# EasyEDA Pro project Hotplate.epro

# Schematic ARCHIVE

## Sheets
1 DRAFT(Sequential Symbols): Create Date: 2024-06-05; Page Name: DRAFT(Sequential Symbols); Project Name: Hotplate; Schematic Name: USB Module; Update Date: 2024-07-03; Company: EasyEDA.com; Drawn: EasyEDA; Page Size: A4; Part Number: JLCPCB-002; Reviewed: EasyEDA; Version: V0.1
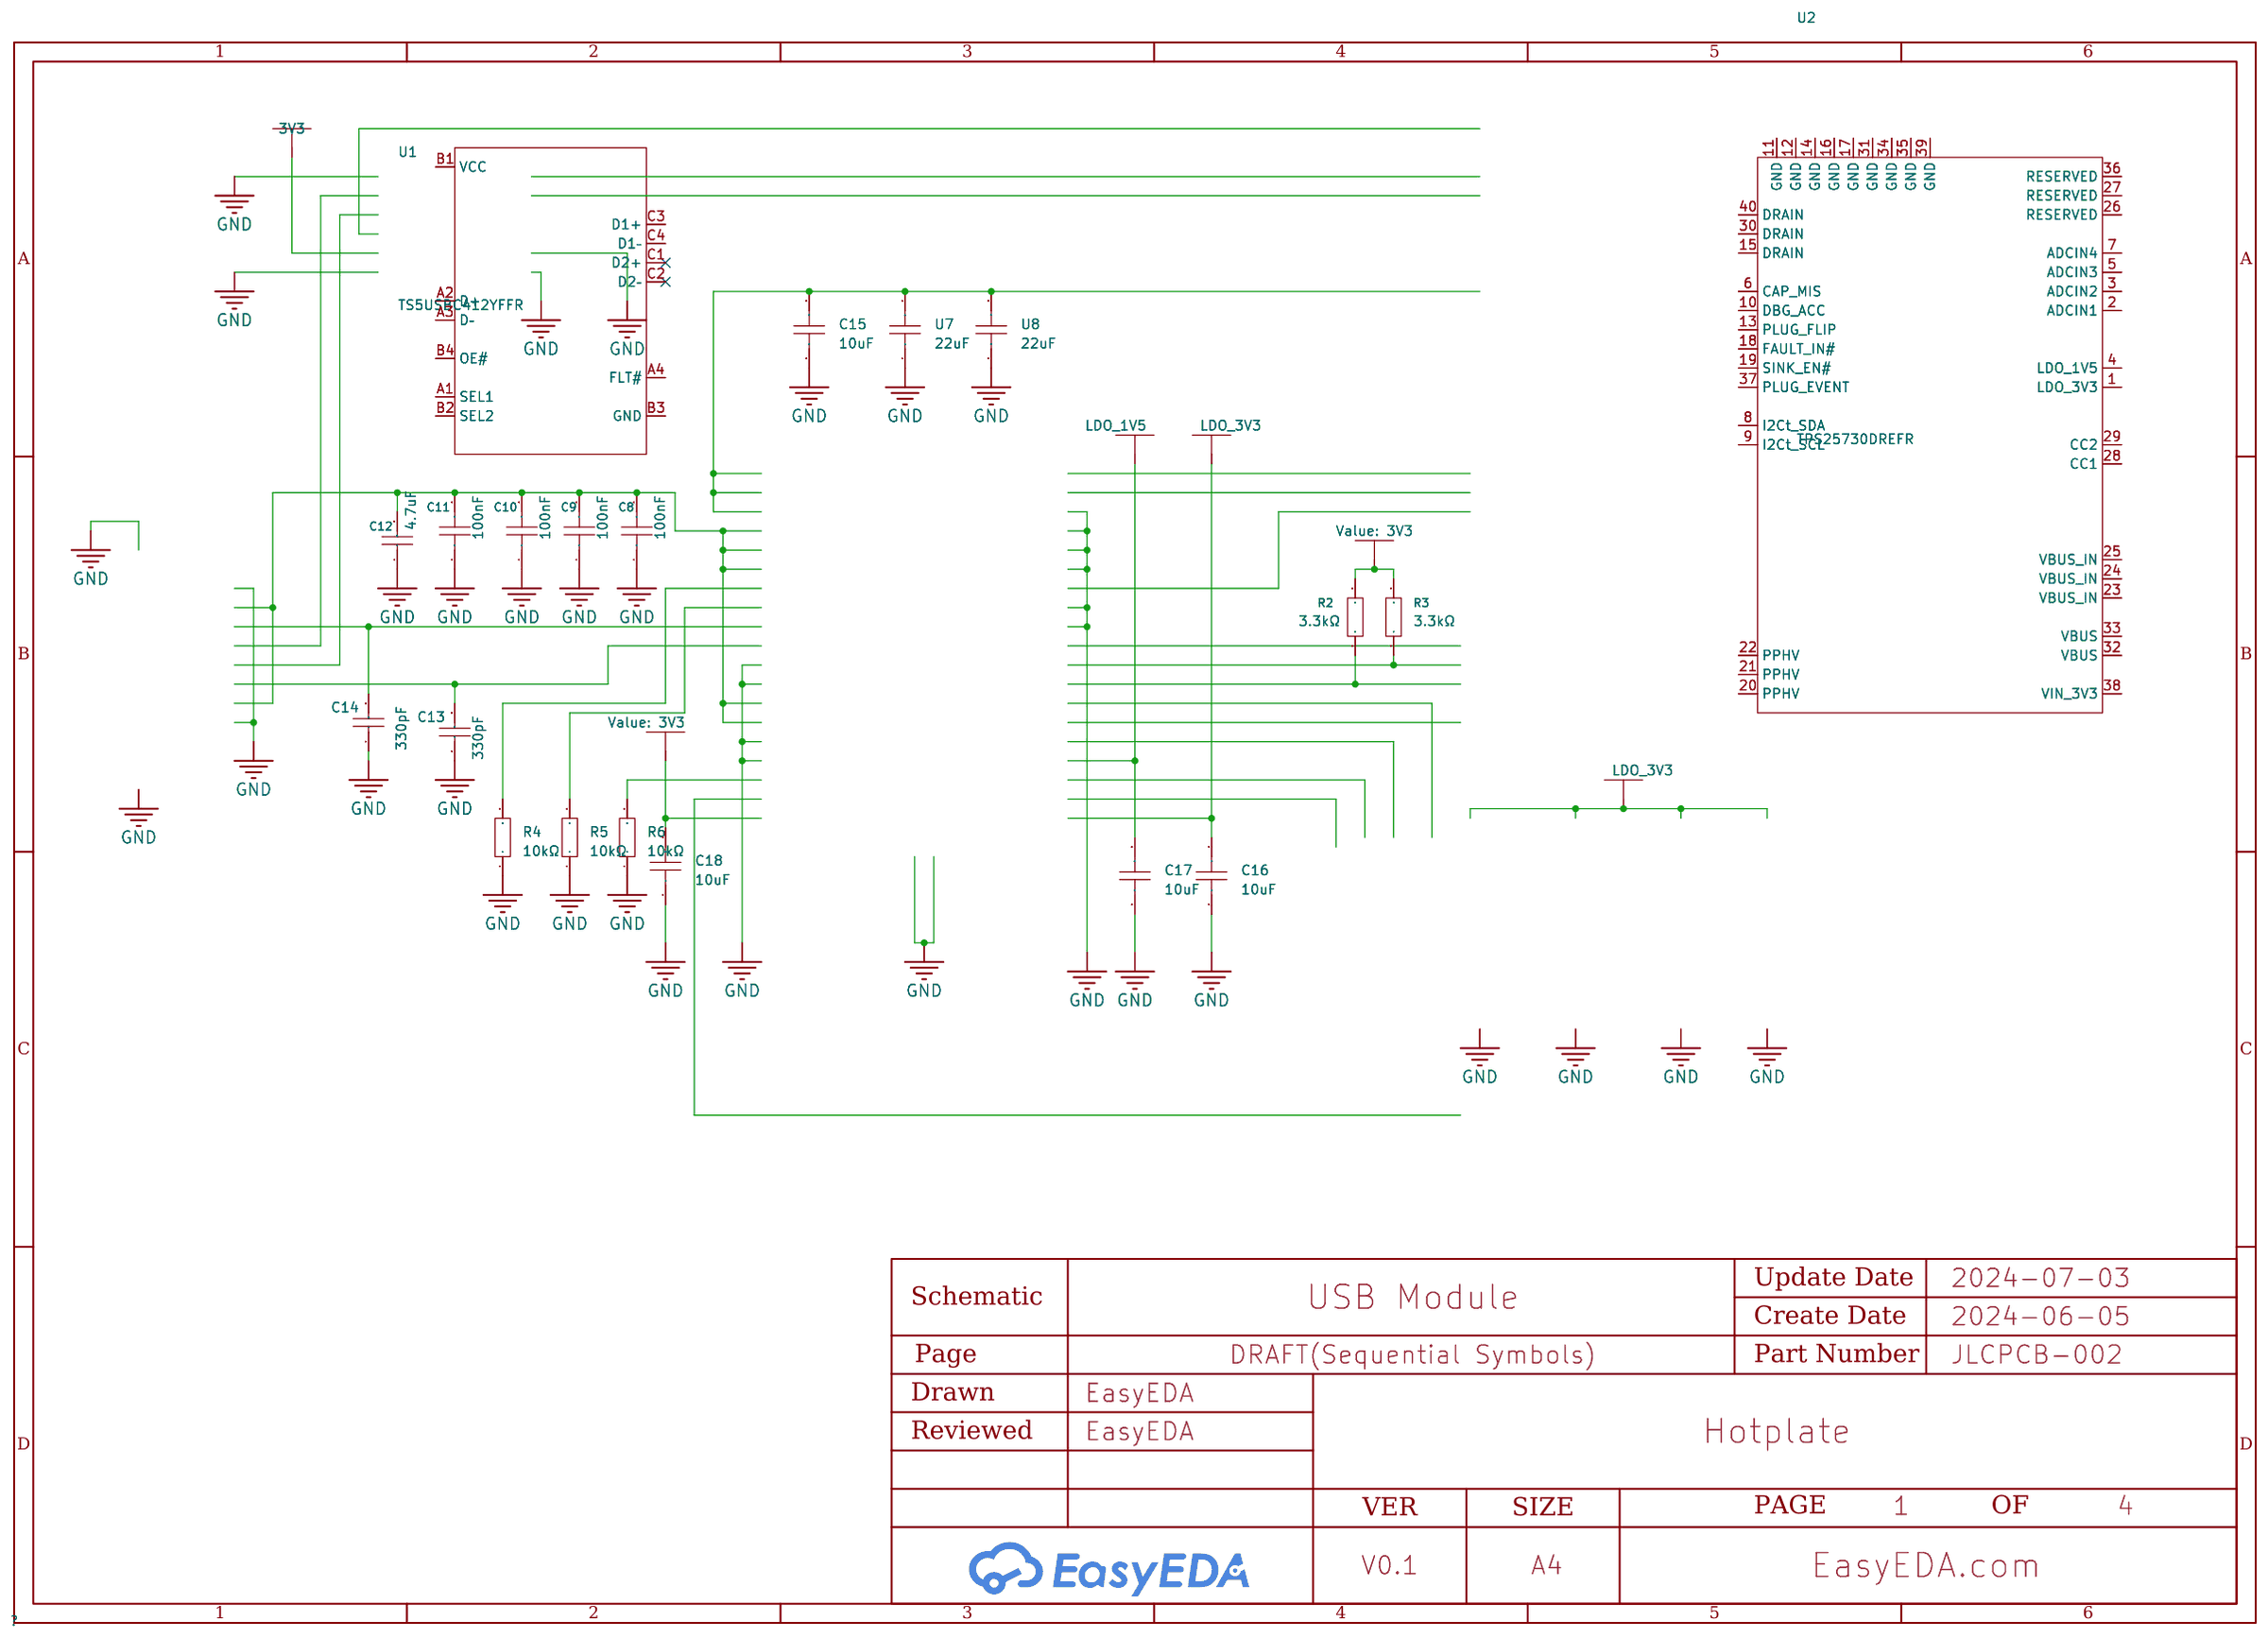
[diagram p0: DRAFT(Sequential Symbols)]
2 Symbols (DELETE): Page Name: Symbols (DELETE); Update Date: 2024-06-05
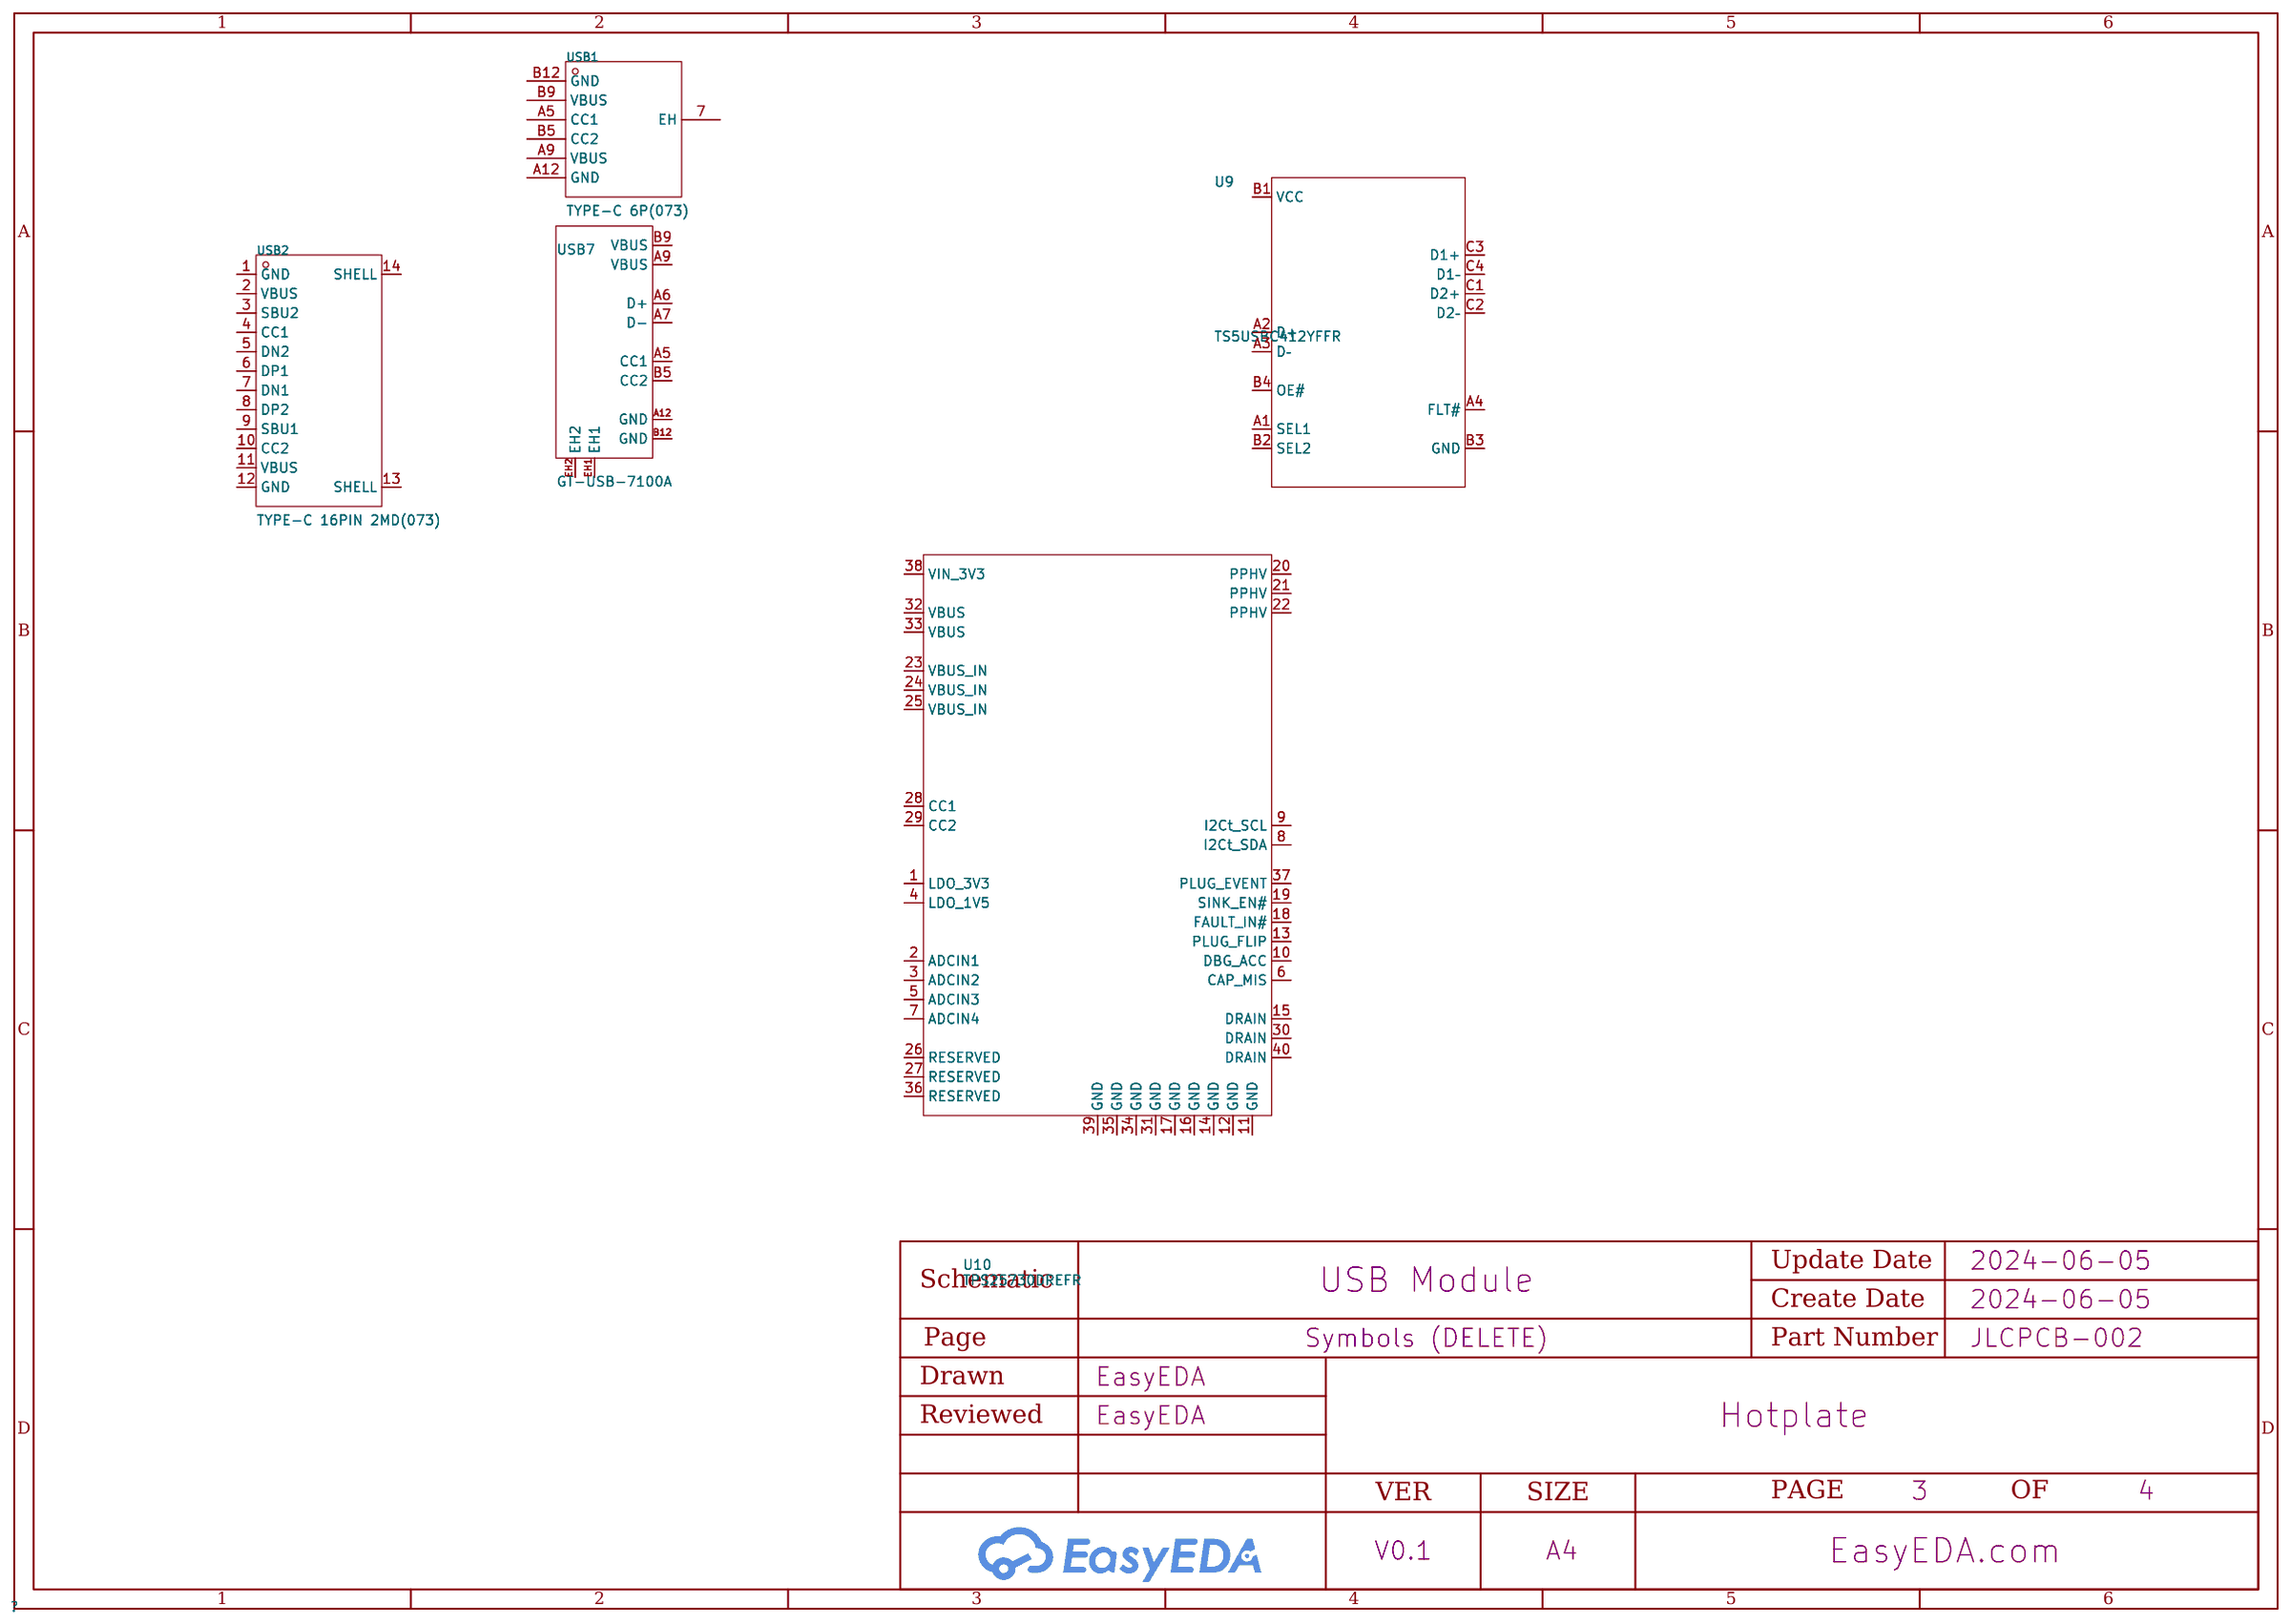
[diagram p1: Symbols (DELETE)]

## Parts
sheet DRAFT(Sequential Symbols)
C8  100nF  [C0603]
C9  100nF  [C0603]
C10  100nF  [C0603]
C11  100nF  [C0603]
C12  4.7uF  [C0603]
C13  330pF  [C0603]
C14  330pF  [C0603]
C15  10uF  [C1210]
C16  10uF  [C1210]
C17  10uF  [C1210]
C18  10uF  [C1210]
R2  3.3kΩ  [R0603]
R3  3.3kΩ  [R0603]
R4  10kΩ  [R0603]
R5  10kΩ  [R0603]
R6  10kΩ  [R0603]
U1  TS5USBC412YFFR  [DSBGA-12_L1.7-W1.3-R4-C3-P0.40-BL]
U2  TPS25730DREFR  [QFN-38_L6.0-W4.0-P0.40-TL-EP_RJK]
U7  22uF  [C1210]
U8  22uF  [C1210]
sheet Symbols (DELETE)
U9  TS5USBC412YFFR  [DSBGA-12_L1.7-W1.3-R4-C3-P0.40-BL]
U10  TPS25730DREFR  [QFN-38_L6.0-W4.0-P0.40-TL-EP_RJK]
USB1  TYPE-C 6P(073)  [TYPE-C-SMD_TYPE-C-6P]
USB2  TYPE-C 16PIN 2MD(073)  [USB-C-SMD_TYPE-C-6PIN-2MD-073]
USB7  GT-USB-7100A  [USB-C-SMD_GT-USB-7100A]

## Library data of the parts
C8-C11 = CC0603KRX7R9BB104: Capacitance: Tolerance:±10% Tolerance:±10% Voltage Rated: Temperature Coefficient:; LCSC Part Name: 100nF ±10% 50V; Supplier Part: C14663; Manufacturer: YAGEO(国巨); Supplier Footprint: 0603; JLCPCB Part Class: Basic Part; Datasheet: https://atta.szlcsc.com/upload/public/pdf/source/20180910/C282072_33301C7F631E79921B82A8DAC6BCC5B3.pdf; Supplier: LCSC; Tolerance: ±10%
C12 = CL10A475KP8NNNC: Capacitance: Tolerance:±10% Tolerance:±10% Voltage Rated: Temperature Coefficient:; LCSC Part Name: 4.7uF ±10% 10V; Supplier Part: C1705; Manufacturer: SAMSUNG(三星); Supplier Footprint: 0603; JLCPCB Part Class: Extended Part; Datasheet: https://atta.szlcsc.com/upload/public/pdf/source/20160218/1457707763339.pdf; Supplier: LCSC; Tolerance: ±10%
C13 C14 = CL10C331JB8NNNC: Capacitance: Tolerance:±5% Tolerance:±5% Voltage Rated: Temperature Coefficient:; LCSC Part Name: 330pF ±5% 50V; Supplier Part: C1664; Manufacturer: SAMSUNG(三星); Supplier Footprint: 0603; JLCPCB Part Class: Basic Part; Datasheet: https://atta.szlcsc.com/upload/public/pdf/source/20160218/1457707763339.pdf; Supplier: LCSC; Tolerance: ±5%
C15-C18 = CS3225X7R106K500NRL: Capacitance: Voltage Rated: Temperature Coefficient:; LCSC Part Name: 10uF 50V; Supplier Part: C2918502; Manufacturer: SAMWHA(三和); Supplier Footprint: 1210; JLCPCB Part Class: Extended Part; Datasheet: https://atta.szlcsc.com/upload/public/pdf/source/20230815/D6EC8E8D4948B4151F2C89DF2FF24A45.pdf; Supplier: LCSC
R2 R3 = 0603WAF3301T5E: Type:Thick Film Resistors Resistance:3.3kΩ Tolerance:±1% Tolerance:±1% Power(Watts): Overload Voltage (Max): Temperature Coefficient:±100ppm/℃ Temperature Coefficient:±100ppm/℃ Operating Temperature Range:-55℃~+155℃ Operating Temperature Range:-55℃~+155℃; LCSC Part Name: 3.3kΩ ±1% 100mW 厚膜电阻; Supplier Part: C22978; Manufacturer: UNI-ROYAL(厚声); Supplier Footprint: 0603; JLCPCB Part Class: Basic Part; Datasheet: https://atta.szlcsc.com/upload/public/pdf/source/20200306/C422600_1E6D84923E4A46A82E41ADD87F860B5C.pdf; Supplier: LCSC; Type: Thick Film Resistors; Tolerance: ±1%; Temperature Coefficient: ±100ppm/℃; Operating Temperature Range: -55℃~+155℃
R4-R6 = RC0603FR-0710KL: Type:Thick Film Resistors Resistance: Tolerance:±1% Tolerance:±1% Power(Watts): Overload Voltage (Max): Temperature Coefficient:±100ppm/℃ Temperature Coefficient:±100ppm/℃ Operating Temperature Range:-55℃~+155℃ Operating Temperature Range:-55℃~+155℃; LCSC Part Name: 厚膜电阻 10kΩ ±1% 100mW; Supplier Part: C98220; Manufacturer: YAGEO(国巨); Supplier Footprint: 0603; JLCPCB Part Class: Extended Part; Datasheet: https://atta.szlcsc.com/upload/public/pdf/source/20180927/C295883_E8D83085EA81BD7DE0B2B681138C15EE.pdf; Supplier: LCSC; Type: Thick Film Resistors; Tolerance: ±1%; Temperature Coefficient: ±100ppm/℃; Operating Temperature Range: -55℃~+155℃
U1 U9 = TS5USBC412YFFR: Switch Circuit:- Number of Channels:2 Supply Voltage:2.3V~5.5V Supply Voltage:2.3V~5.5V On-State Resistance (Max):9Ω Operating Temperature:0℃~+70℃ Operating Temperature:0℃~+70℃; Supplier Part: C2150852; Manufacturer: TI(德州仪器); Supplier Footprint: DSBGA-12; JLCPCB Part Class: Extended Part; Datasheet: https://www.ti.com/cn/lit/gpn/ts5usbc41; Supplier: LCSC; Number of Channels: 2; Supply Voltage: 2.3V~5.5V; On-State Resistance (Max): 9Ω; Operating Temperature: 0℃~+70℃
U2 U10 = TPS25730DREFR: Supplier Part: C22438973; Supplier Footprint: QFN38-4X6-0.4; JLCPCB Part Class: Extended Part; Supplier: LCSC
U7 U8 = CGA1210X5R226K350RT: Capacitance:22uF Tolerance:±10% Tolerance:±10% Voltage Rated: Temperature Coefficient:; LCSC Part Name: 22uF ±10% 35V; Supplier Part: C6120016; Manufacturer: HRE(芯声); Supplier Footprint: 1210; JLCPCB Part Class: Extended Part; Datasheet: https://atta.szlcsc.com/upload/public/pdf/source/20240229/B394560356D0E8099C4BF336FC93CE67.pdf; Supplier: LCSC; Tolerance: ±10%
USB1 = TYPE-C 6P(073): Connector Type:Type-C Standard:- Gender:Female Number of Ports:1 Number of Contacts:6P Mounting Style:卧贴 Current Rating - Power (Max):5A Operating Temperature Range:-25℃~+85℃ Operating Temperature Range:-25℃~+85℃; LCSC Part Name: Type-C 母 卧贴; Supplier Part: C668623; Manufacturer: SHOU HAN(首韩); Supplier Footprint: SMD; JLCPCB Part Class: Extended Part; Datasheet: https://atta.szlcsc.com/upload/public/pdf/source/20200618/C668623_A4B260DED7AC1949BAC6AE39E9F4CD80.pdf; Supplier: LCSC; Connector Type: Type-C; Gender: Female; Number of Ports: 1; Number of Contacts: 6P; Mounting Style: 卧贴; Current Rating - Power (Max): 5A; Operating Temperature Range: -25℃~+85℃
USB2 = TYPE-C 16PIN 2MD(073): Connector Type:Type-C Standard:- Gender:Female Number of Ports:1 Number of Contacts:16P Mounting Style:卧贴 Current Rating - Power (Max):5A Operating Temperature Range:-25℃~+85℃ Operating Temperature Range:-25℃~+85℃; LCSC Part Name: Type-C 母 卧贴; Supplier Part: C2765186; Manufacturer: SHOU HAN(首韩); Supplier Footprint: SMD; JLCPCB Part Class: Extended Part; Datasheet: https://atta.szlcsc.com/upload/public/pdf/source/20211123/39B17C16241EAC15C5E277BDA434118E.pdf; Supplier: LCSC; Connector Type: Type-C; Gender: Female; Number of Ports: 1; Number of Contacts: 16P; Mounting Style: 卧贴; Current Rating - Power (Max): 5A; Operating Temperature Range: -25℃~+85℃
USB7 = GT-USB-7100A: Connector Type:Type-C Standard:USB 2.0 Gender:Female Number of Ports:1 Number of Contacts:8P Mounting Style:Sink board Current Rating - Power (Max):5A Contact Material:高导铜 Contact Plating:Gold Operating Temperature Range:-40℃~+85℃ Operating Temperature Ra; LCSC Part Name: Type-C 母 沉板; Supplier Part: C7469646; Manufacturer: G-Switch(品赞); Supplier Footprint: SMD; JLCPCB Part Class: Extended Part; Datasheet: https://atta.szlcsc.com/upload/public/pdf/source/20240103/5A98FEF604E8D03CC845D83CAD1837C7.pdf; Supplier: LCSC; Connector Type: Type-C; Standard: USB 2.0; Gender: Female; Number of Ports: 1; Number of Contacts: 8P; Mounting Style: Sink board; Current Rating - Power (Max): 5A; Contact Material: 高导铜; Contact Plating: Gold; Operating Temperature Range: -40℃~+85℃

## Nets
3V3: C18.2 R2.1 R3.2
GND: C8.1 C9.1 C10.1 C11.1 C12.1 C13.1 C14.1 C15.1 C16.1 C17.1 C18.1 R4.1 R5.1 R6.1 U7.1 U8.1
LDO_1V5: C17.2
LDO_3V3: C16.2
Net-(C8-2): C8.2 C9.2 C10.2 C11.2 C12.2
Net-(C15-2): C15.2 U7.2 U8.2

Not connected (* = marked no-connect by the designer): C13 2; C14 2; R2 2; R3 1; R4 2; R5 2; R6 2; U1 A1(SEL1) A2(D+) A3(D–) A4(FLT#) B1(VCC) B2(SEL2) B3(GND) B4(OE#) C1(D2+)* C2(D2–)* C3(D1+) C4(D1–); U2 1(LDO_3V3) 2(ADCIN1) 3(ADCIN2) 4(LDO_1V5) 5(ADCIN3) 6(CAP_MIS) 7(ADCIN4) 8(I2Ct_SDA) 9(I2Ct_SCL) 10(DBG_ACC) 11(GND) 12(GND) 13(PLUG_FLIP) 14(GND) 15(DRAIN) 16(GND) 17(GND) 18(FAULT_IN#) 19(SINK_EN#) 20(PPHV) 21(PPHV) 22(PPHV) 23(VBUS_IN) 24(VBUS_IN) 25(VBUS_IN) 26(RESERVED) 27(RESERVED) 28(CC1) 29(CC2) 30(DRAIN) 31(GND) 32(VBUS) 33(VBUS) 34(GND) 35(GND) 36(RESERVED) 37(PLUG_EVENT) 38(VIN_3V3) 39(GND) 40(DRAIN); U9 A1(SEL1) A2(D+) A3(D–) A4(FLT#) B1(VCC) B2(SEL2) B3(GND) B4(OE#) C1(D2+) C2(D2–) C3(D1+) C4(D1–); U10 1(LDO_3V3) 2(ADCIN1) 3(ADCIN2) 4(LDO_1V5) 5(ADCIN3) 6(CAP_MIS) 7(ADCIN4) 8(I2Ct_SDA) 9(I2Ct_SCL) 10(DBG_ACC) 11(GND) 12(GND) 13(PLUG_FLIP) 14(GND) 15(DRAIN) 16(GND) 17(GND) 18(FAULT_IN#) 19(SINK_EN#) 20(PPHV) 21(PPHV) 22(PPHV) 23(VBUS_IN) 24(VBUS_IN) 25(VBUS_IN) 26(RESERVED) 27(RESERVED) 28(CC1) 29(CC2) 30(DRAIN) 31(GND) 32(VBUS) 33(VBUS) 34(GND) 35(GND) 36(RESERVED) 37(PLUG_EVENT) 38(VIN_3V3) 39(GND) 40(DRAIN); USB1 7(EH) A5(CC1) A9(VBUS) A12(GND) B5(CC2) B9(VBUS) B12(GND); USB2 1(GND) 2(VBUS) 3(SBU2) 4(CC1) 5(DN2) 6(DP1) 7(DN1) 8(DP2) 9(SBU1) 10(CC2) 11(VBUS) 12(GND) 13(SHELL) 14(SHELL); USB7 A5(CC1) A6(D+) A7(D-) A9(VBUS) A12(GND) B5(CC2) B9(VBUS) B12(GND) EH1 EH2

# Schematic USB Module

## Sheets
1 DCDC_3V3: Create Date: 2024-06-05; Page Name: DCDC_3V3; Project Name: Hotplate; Schematic Name: USB Module; Update Date: 2024-07-03; Company: EasyEDA.com; Drawn: EasyEDA; Page Size: A4; Part Number: JLCPCB-002; Reviewed: EasyEDA; Version: V0.1
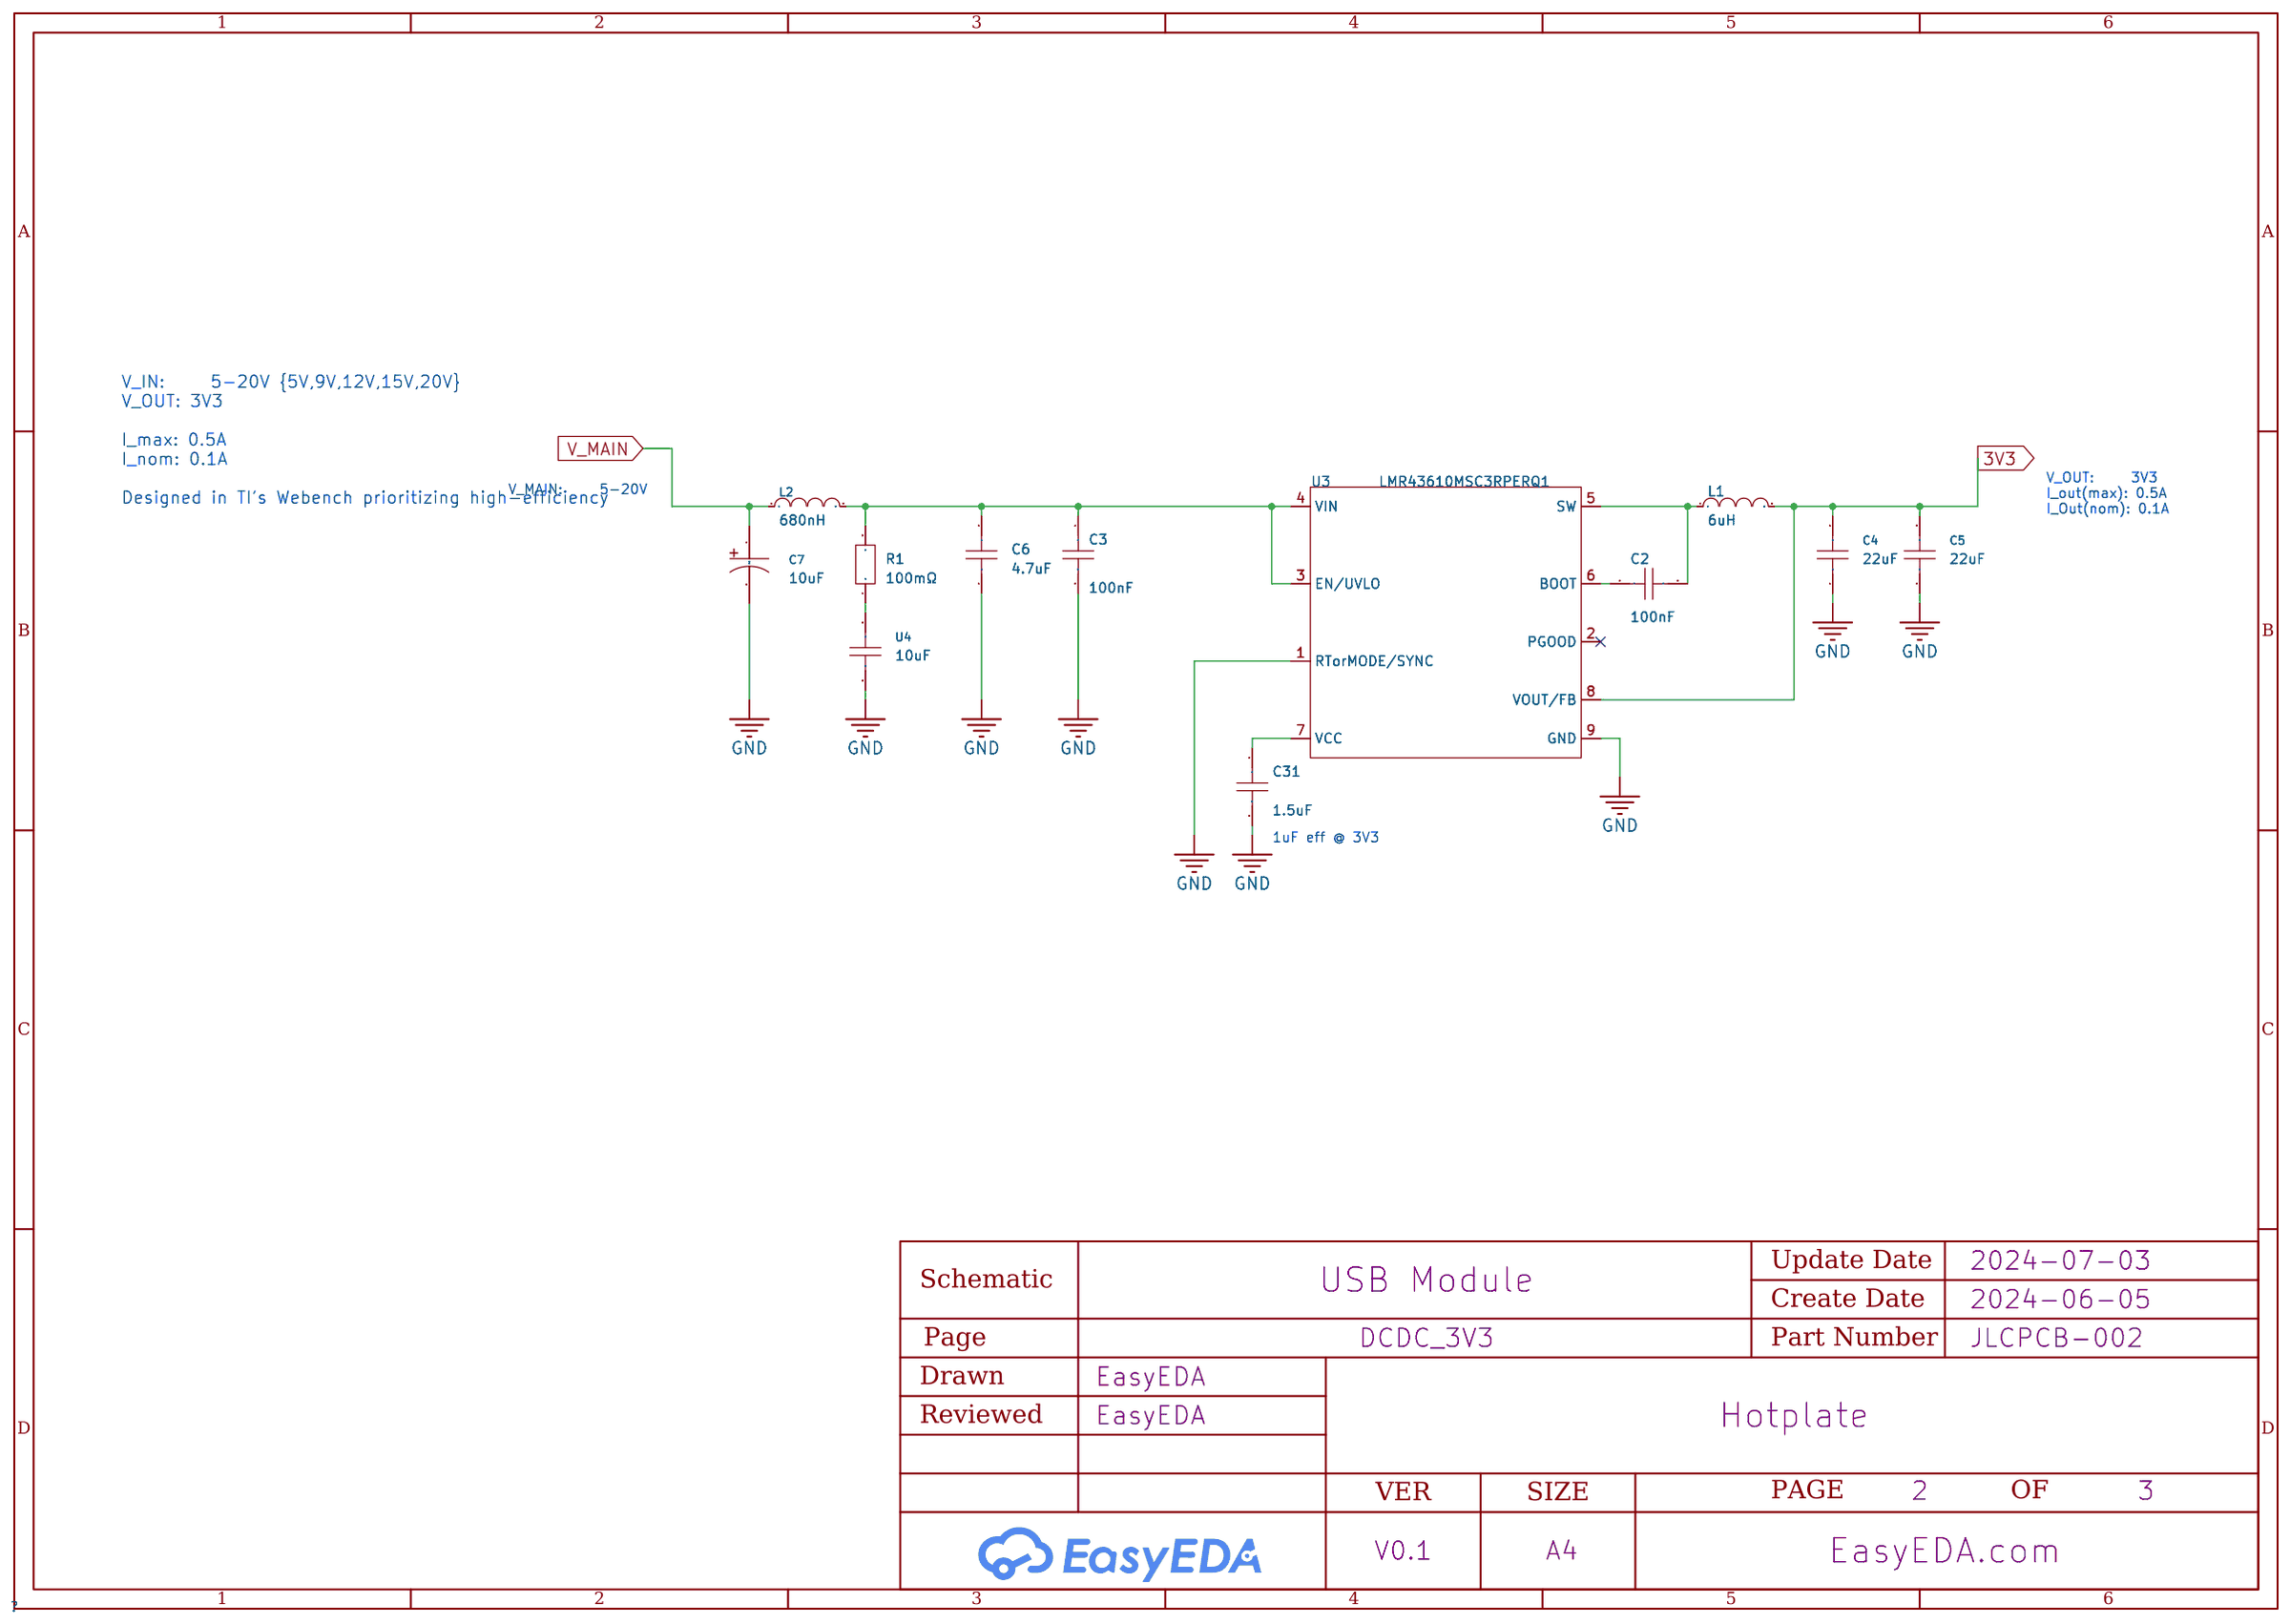
[diagram p2: DCDC_3V3]
2 USB: Page Name: USB
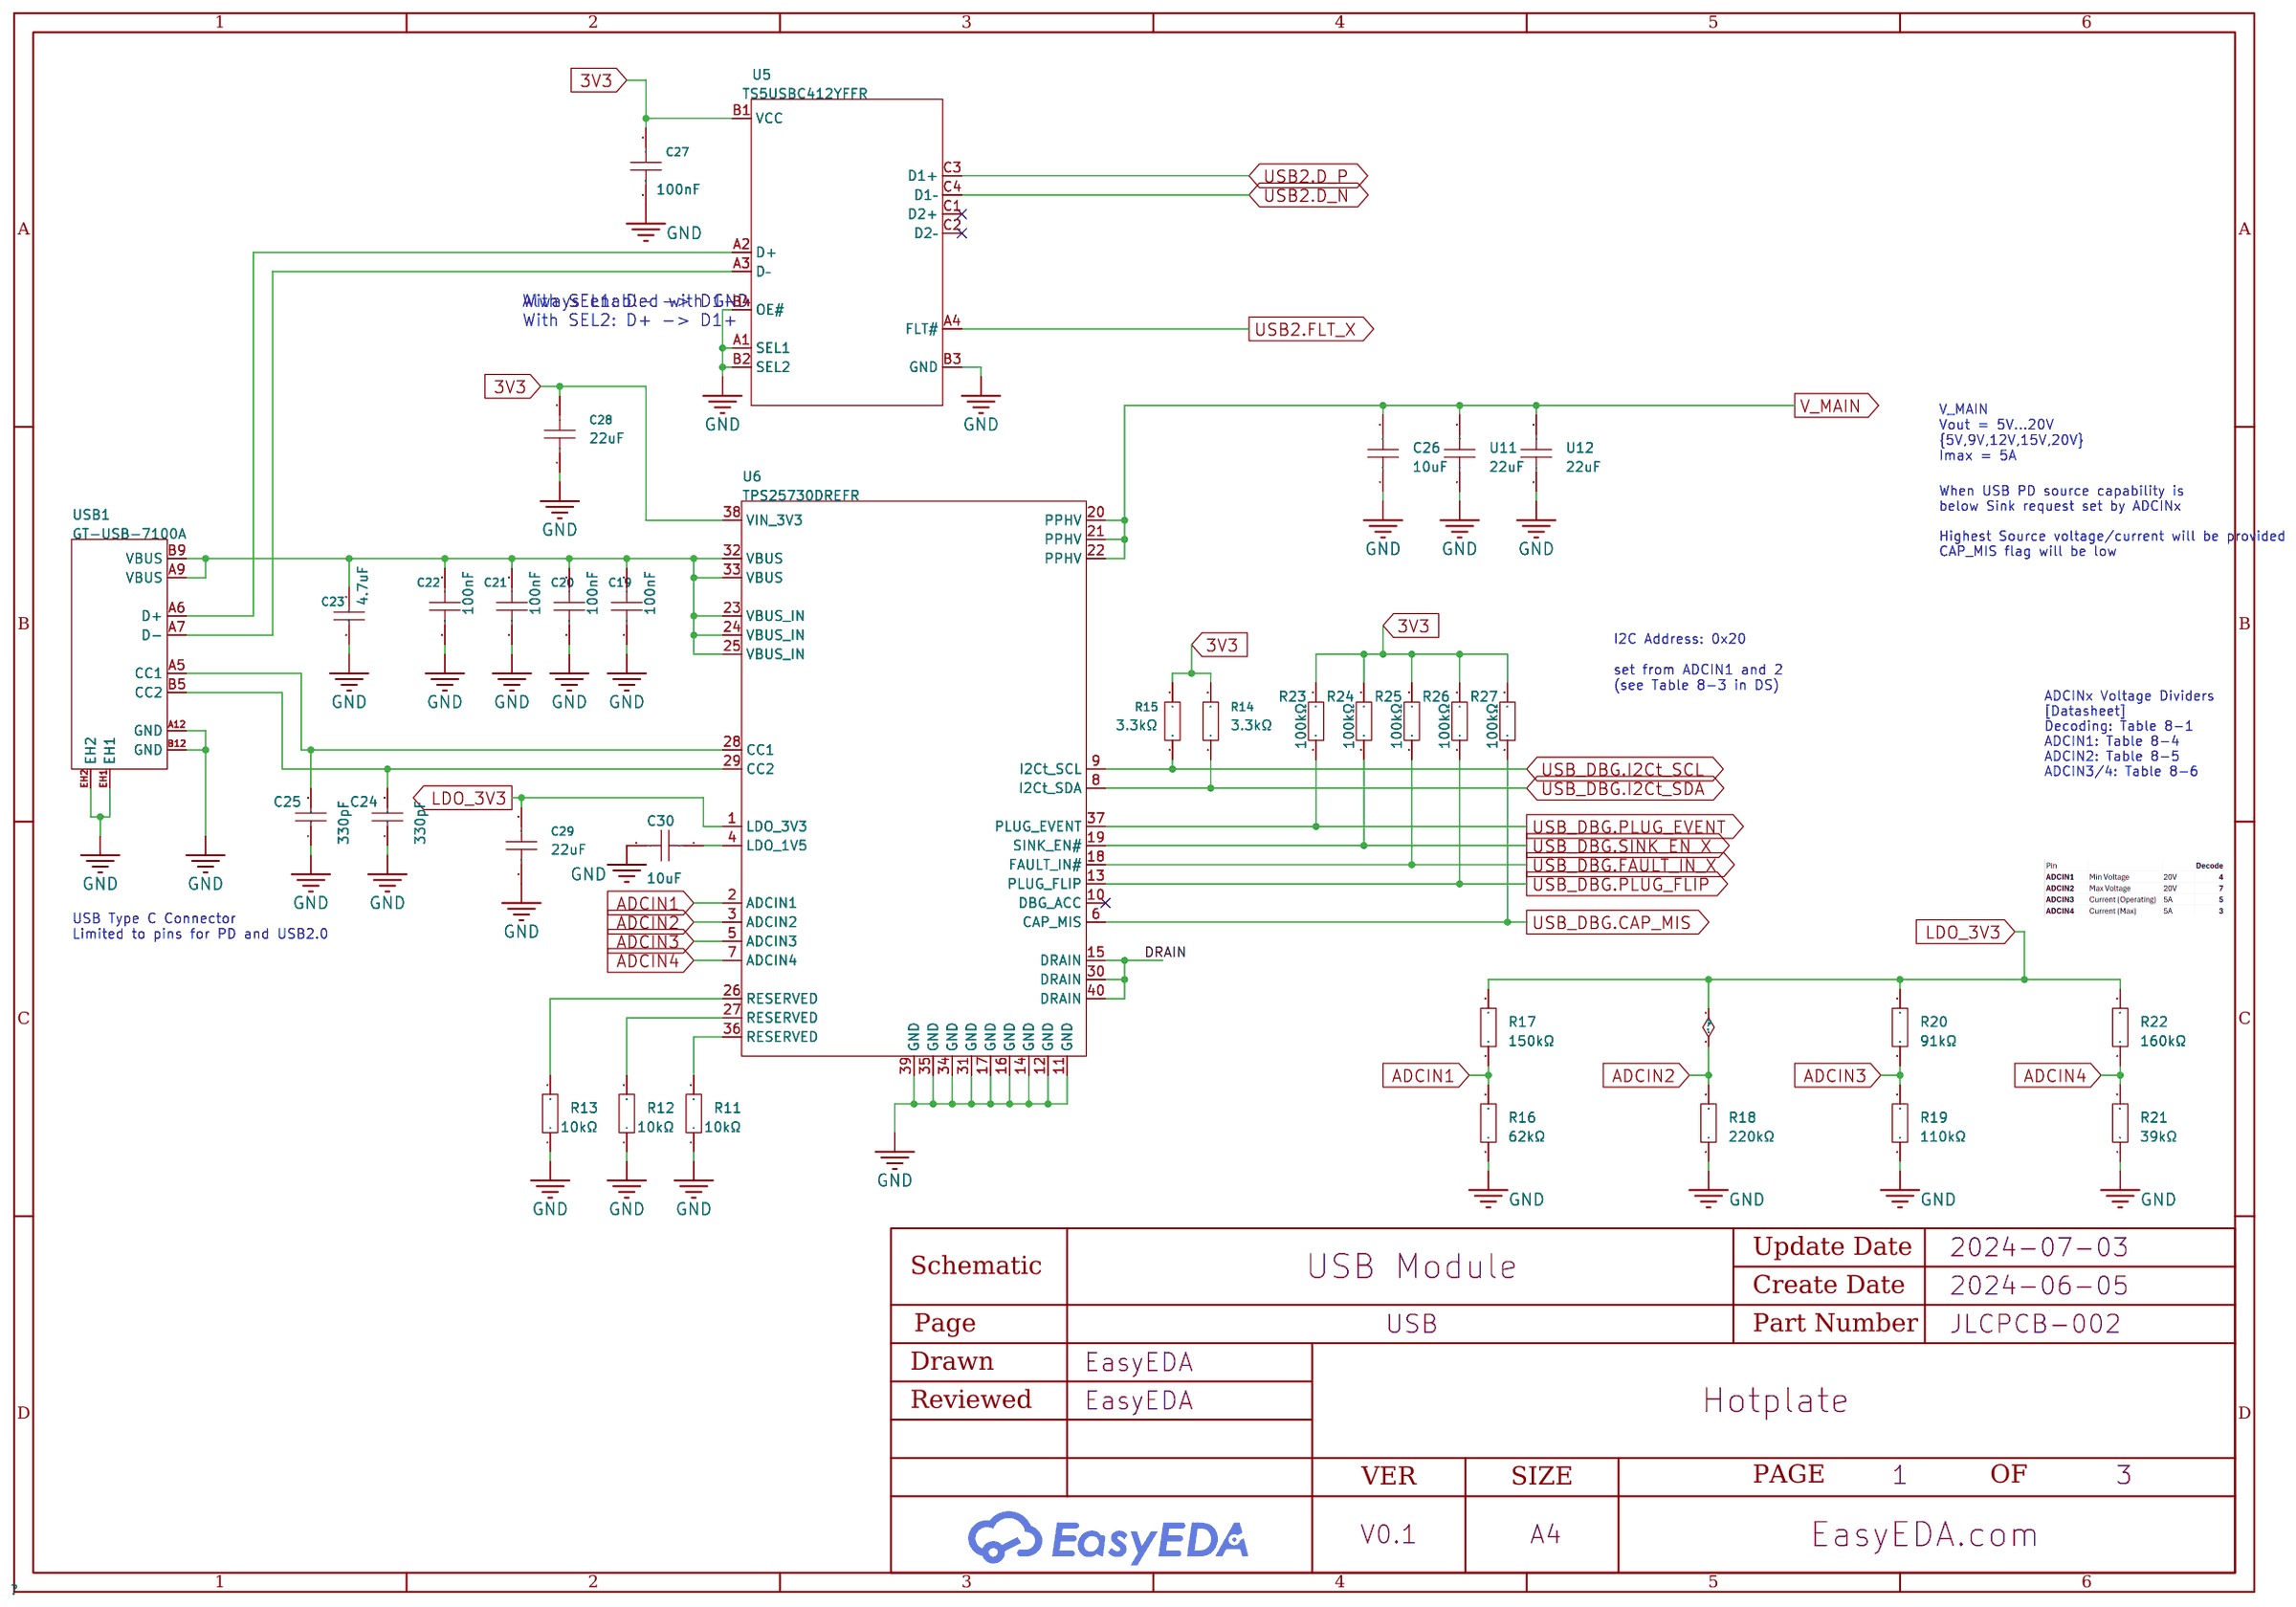
[diagram p3: USB]
3 Module Interface: Create Date: 2024-07-03; Page Name: Module Interface
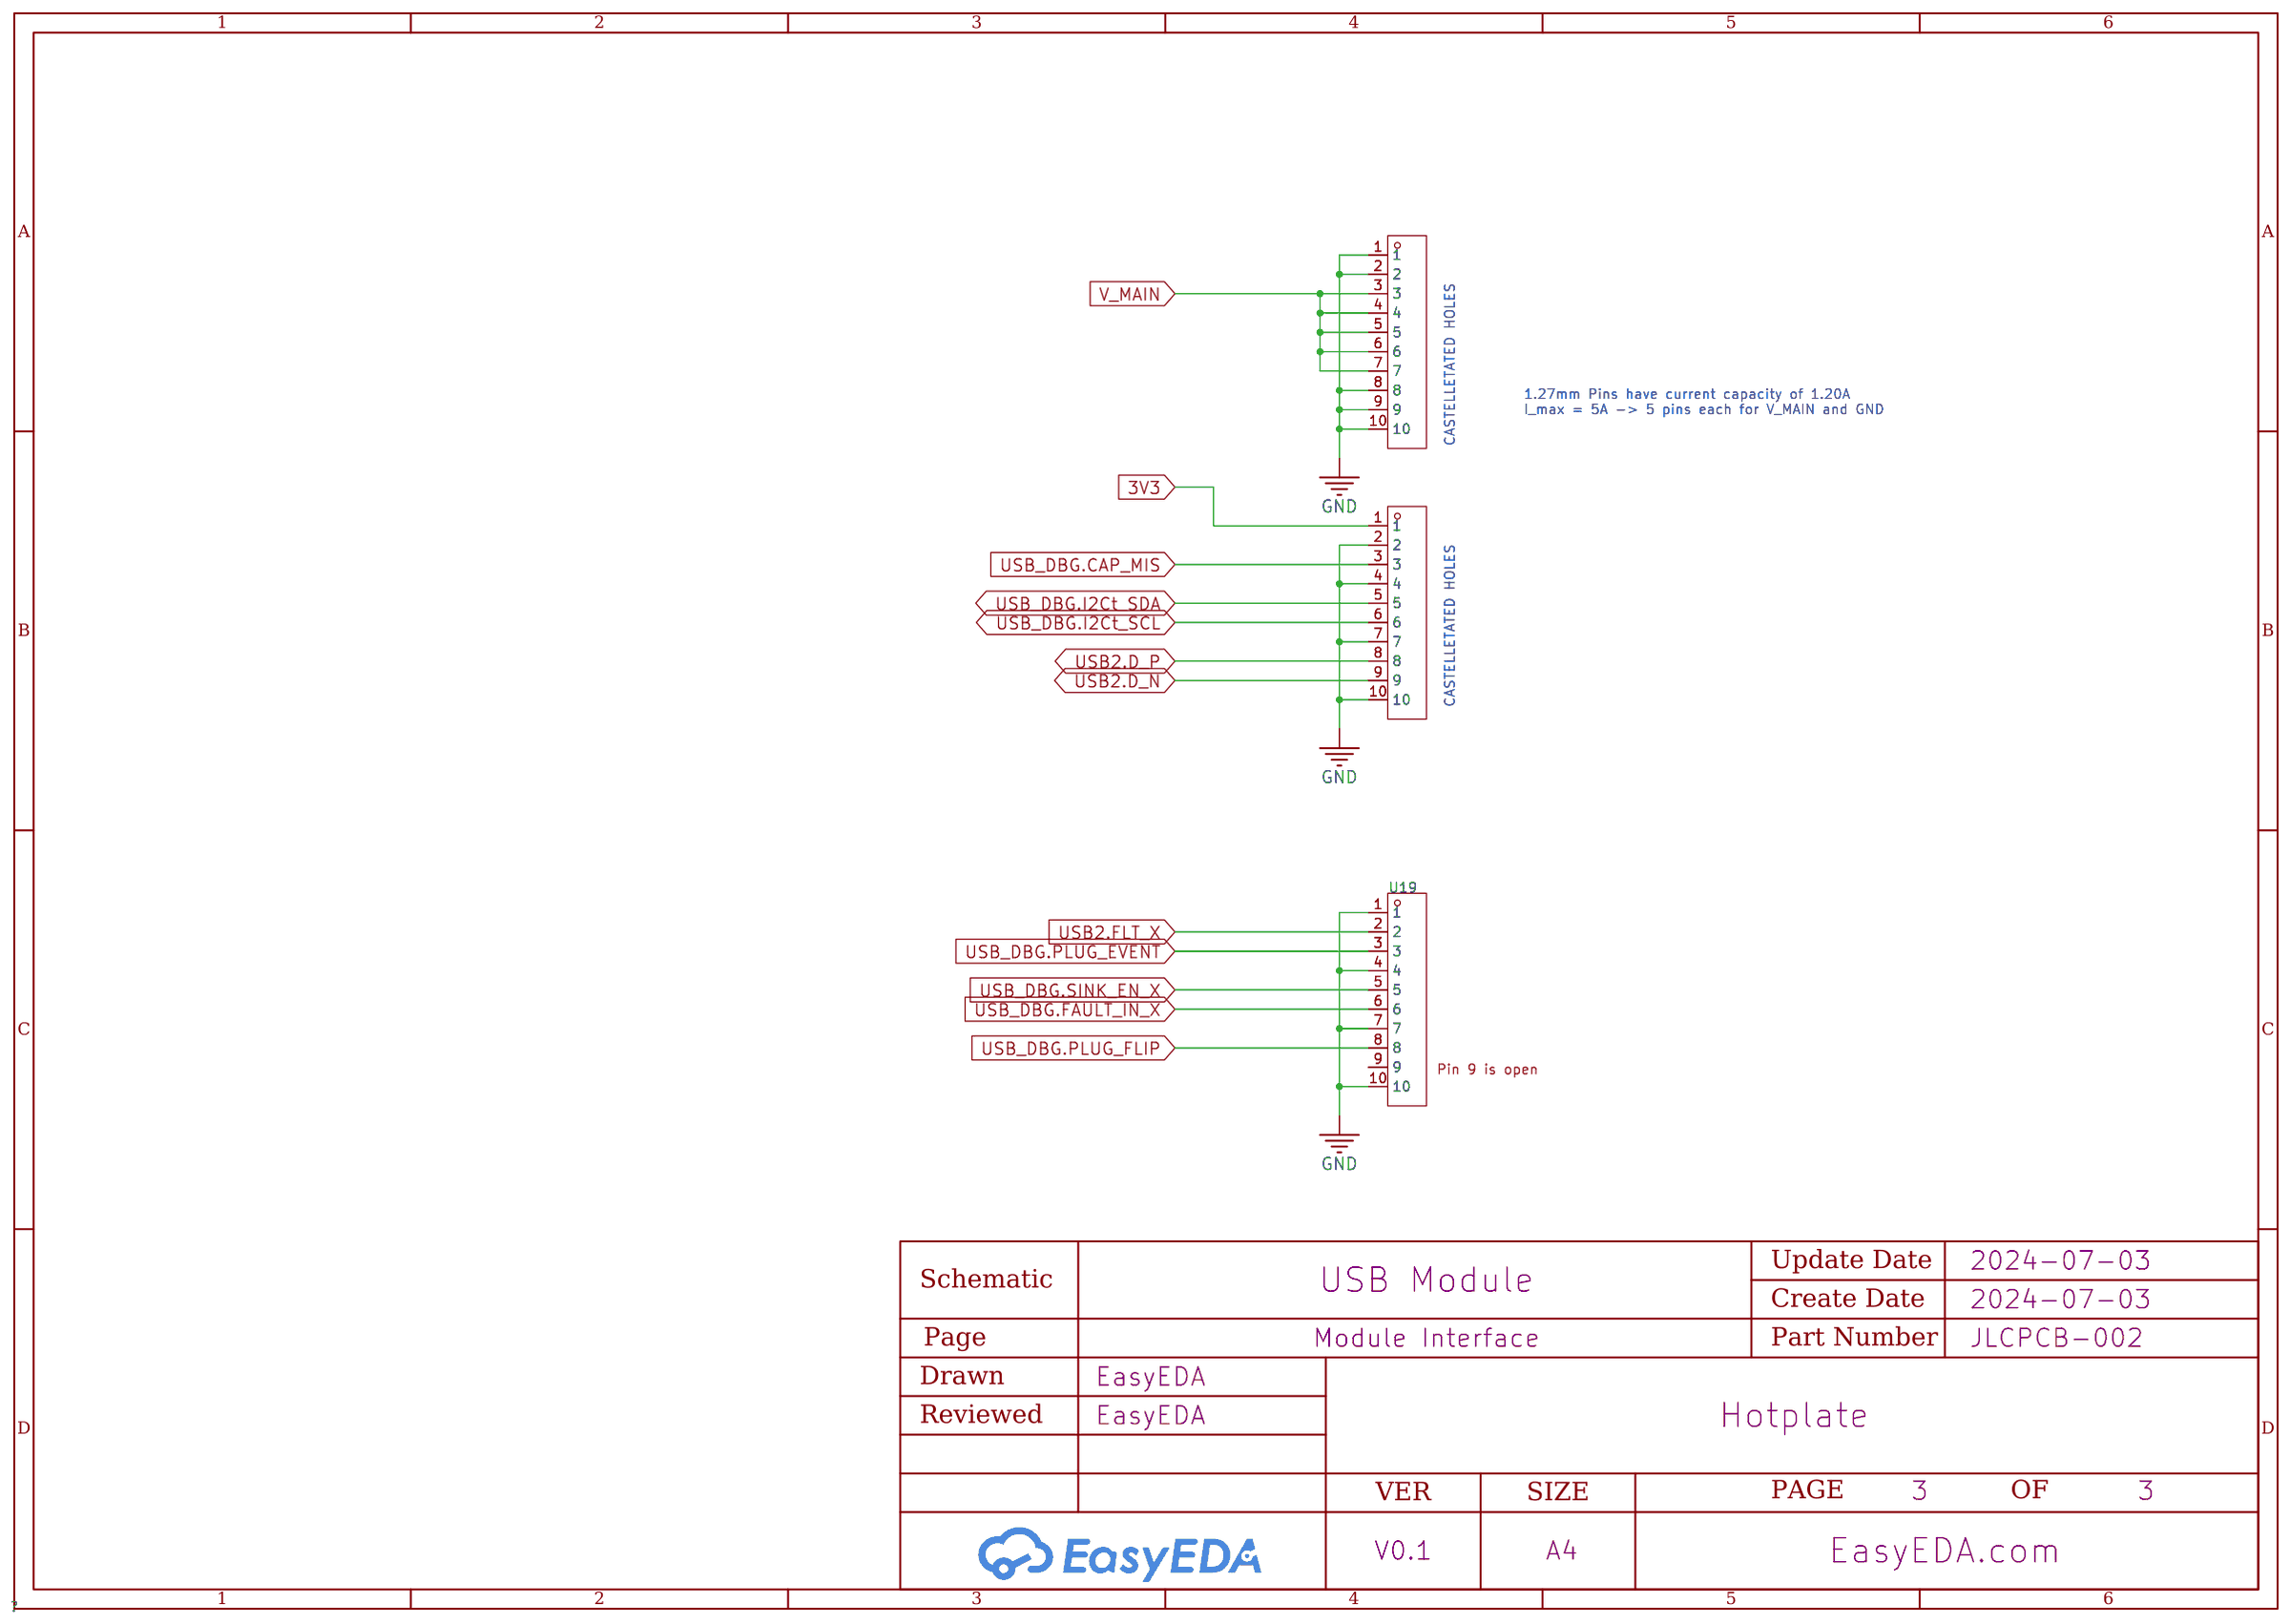
[diagram p4: Module Interface]

## Parts
sheet DCDC_3V3
C2  100nF  [C0402]
C3  100nF  [C0603]
C4  22uF  [C1206]
C5  22uF  [C1206]
C6  4.7uF  [C0603]
C7  10uF  [CAP-SMD_BD4.0-L4.3-W4.3-FD]
C31  1.5uF  [C0603]
L1  6uH  [IND-SMD_L6.7-W6.7]
L2  680nH  [IND-SMD_L2.5-W2.0_SWPA2520]
R1  100mΩ  [R0603]
U3  LMR43610MSC3RPERQ1  [VQFN-9_L2.1-W2.1-P0.50-TL]
U4  10uF  [C1210]
sheet Module Interface
U17  GPEC132-1002A025R1ZF  [HDR-SMD_10P-P1.27-V-M-LS5.5-R1]
U18  GPEC132-1002A025R1ZF  [HDR-SMD_10P-P1.27-V-M-LS5.5-R1]
U19  GPEC132-1002A025R1ZF  [HDR-SMD_10P-P1.27-V-M-LS5.5-R1]
sheet USB
C19  100nF  [C0603]
C20  100nF  [C0603]
C21  100nF  [C0603]
C22  100nF  [C0603]
C23  4.7uF  [C0603]
C24  330pF  [C0603]
C25  330pF  [C0603]
C26  10uF  [C1210]
C27  100nF  [C0603]
C28  22uF  [C0603]
C29  22uF  [C0603]
C30  10uF  [C1210]
R11  10kΩ  [R0603]
R12  10kΩ  [R0603]
R13  10kΩ  [R0603]
R14  3.3kΩ  [R0603]
R15  3.3kΩ  [R0603]
R16  62kΩ  [R0603]
R17  150kΩ  [R0603]
R18  220kΩ  [R0603]
R19  110kΩ  [R0603]
R20  91kΩ  [R0603]
R21  39kΩ  [R0603]
R22  160kΩ  [R0603]
R23  100kΩ  [R0603]
R24  100kΩ  [R0603]
R25  100kΩ  [R0603]
R26  100kΩ  [R0603]
R27  100kΩ  [R0603]
U5  TS5USBC412YFFR  [DSBGA-12_L1.7-W1.3-R4-C3-P0.40-BL]
U6  TPS25730DREFR  [QFN-38_L6.0-W4.0-P0.40-TL-EP_RJK]
U11  22uF  [C1210]
U12  22uF  [C1210]
USB1  GT-USB-7100A  [USB-C-SMD_GT-USB-7100A]

## Library data of the parts
C2 = CGA2B3X7R1H104K050BB: Capacitance: Tolerance:±10% Tolerance:±10% Voltage Rated: Temperature Coefficient:; LCSC Part Name: 100nF ±10% 50V; Supplier Part: C2167391; Manufacturer: TDK; Supplier Footprint: 0402; JLCPCB Part Class: Extended Part; Datasheet: https://atta.szlcsc.com/upload/public/pdf/source/20210430/BD8671736ED62E65BA506F30C3AAED50.pdf; Supplier: LCSC; Tolerance: ±10%
C3 = CGA3E2X7R1H104K080AE: Capacitance: Tolerance:±10% Tolerance:±10% Voltage Rated: Temperature Coefficient:; LCSC Part Name: 100nF ±10% 50V; Supplier Part: C2168922; Manufacturer: TDK; Supplier Footprint: 0603; JLCPCB Part Class: Extended Part; Datasheet: https://atta.szlcsc.com/upload/public/pdf/source/20210430/C200C31AE2B660F751EAC3ACFC19C1F0.pdf; Supplier: LCSC; Tolerance: ±10%
C4 C5 = GRM31CR71A226KE15L: Capacitance: Tolerance:±10% Tolerance:±10% Voltage Rated: Temperature Coefficient:; LCSC Part Name: 22uF ±10% 10V; Supplier Part: C91604; Manufacturer: muRata(村田); Supplier Footprint: 1206; JLCPCB Part Class: Extended Part; Datasheet: https://atta.szlcsc.com/upload/public/pdf/source/20161226/1482720175450.pdf; Supplier: LCSC; Tolerance: ±10%
C6 = C1608X5R1V475K080AC: Capacitance: Tolerance:±10% Tolerance:±10% Voltage Rated: Temperature Coefficient:; LCSC Part Name: 4.7uF ±10% 35V; Supplier Part: C3842329; Manufacturer: TDK; Supplier Footprint: 0603; JLCPCB Part Class: Extended Part; Datasheet: https://atta.szlcsc.com/upload/public/pdf/source/20230606/A83975C7E70EF5AFCD4A17254ABD78F2.pdf; Supplier: LCSC; Tolerance: ±10%
C7 = EEEFK1V100UR: Capacitance: Tolerance:±20% Tolerance:±20% Rated Voltage: Ripple Current:67.5mA@120Hz Equivalent Series Resistance(ESR):- φD: L: Lifetime @ Temp:2000hrs@105℃ Operating Temperature:-55℃~+105℃ Operating Temperature:-55℃~+105℃; LCSC Part Name: 10uF ±20% 35V; Supplier Part: C178558; Manufacturer: PANASONIC(松下); Supplier Footprint: SMD,D4xL5.8mm; JLCPCB Part Class: Extended Part; Datasheet: https://atta.szlcsc.com/upload/public/pdf/source/20180830/C242125_A6B570BC3E288FC2E03BFF90EF946F05.pdf; Supplier: LCSC; Tolerance: ±20%; Ripple Current: 67.5mA@120Hz; Lifetime @ Temp: 2000hrs@105℃; Operating Temperature: -55℃~+105℃
C31 = CGA3E3X7S1A155M080AB: Capacitance: Tolerance:±20% Tolerance:±20% Voltage Rated: Temperature Coefficient:; LCSC Part Name: 1.5uF ±20% 10V; Supplier Part: C2182434; Manufacturer: TDK; Supplier Footprint: 0603; JLCPCB Part Class: Extended Part; Datasheet: https://atta.szlcsc.com/upload/public/pdf/source/20210430/BD8671736ED62E65BA506F30C3AAED50.pdf; Supplier: LCSC; Tolerance: ±20%
L1 = ASPI-0602S-6R0M-T: Inductance: Tolerance:±20% Tolerance:±20% Rated Current: Saturation Current (Isat):- DC Resistance (DCR): Type:- Ratings:-; LCSC Part Name: 6uH ±20%; Supplier Part: C187301; Manufacturer: ABRACON; Supplier Footprint: SMD,6.7x6.7mm; JLCPCB Part Class: Extended Part; Datasheet: https://atta.szlcsc.com/upload/public/pdf/source/20180803/C187315_E0A1AA5DE971509CB833CD648700A8A6.pdf; Supplier: LCSC; Tolerance: ±20%
L2 = FHD252010S-R68MT: Inductance:680nH Tolerance:±20% Tolerance:±20% Rated Current:3.2A Saturation Current (Isat):3.6A DC Resistance (DCR):49mΩ; LCSC Part Name: 680nH ±20% 3.6A; Supplier Part: C602002; Manufacturer: cjiang(长江微电); Supplier Footprint: 1008; JLCPCB Part Class: Extended Part; Datasheet: https://atta.szlcsc.com/upload/public/pdf/source/20200609/C601990_BCEA243EC4DA0A9A288AA78A6DFB48A5.pdf; Supplier: LCSC; Tolerance: ±20%; Rated Current: 3.2A; Saturation Current (Isat): 3.6A; DC Resistance (DCR): 49mΩ
R1 = ERJ3RSFR10V: Type:Current Sensing Resistors Resistance:100mΩ Tolerance:±1% Tolerance:±1% Rated Output Voltage:- Power(Watts): Rated Current:- Temperature Coefficient:0ppm/℃~+300ppm/℃ Temperature Coefficient:0ppm/℃~+300ppm/℃ Mounting Sytle:Surface Mount; LCSC Part Name: 100mΩ ±1% 100mW; Supplier Part: C713431; Manufacturer: PANASONIC(松下); Supplier Footprint: 0603; JLCPCB Part Class: Extended Part; Datasheet: https://atta.szlcsc.com/upload/public/pdf/source/20200731/C713431_7C1C7B732DEE918470D89D30ABA99AA6.pdf; Supplier: LCSC; Type: Current Sensing Resistors; Tolerance: ±1%; Temperature Coefficient: 0ppm/℃~+300ppm/℃; Mounting Sytle: Surface Mount
U3 = LMR43610MSC3RPERQ1: Function:Step-down type Input Voltage:3V~36V Input Voltage:3V~36V Output Voltage:1V~32V Output Voltage:1V~32V Output Current (Max):1A Switching Frequency:2.2MHz Operating Temperature:-40℃~+150℃@(TJ) Operating Temperature:-40℃~+150℃@(TJ) Synchronous Rectif; Supplier Part: C5219290; Supplier Footprint: VQFN-9-HR(2x2); JLCPCB Part Class: Extended Part; Datasheet: https://atta.szlcsc.com/upload/public/pdf/source/20230922/4D0DCE34E1BFF901C6DDC9ACCB1D42E9.pdf; Supplier: LCSC; Function: Step-down type; Input Voltage: 3V~36V; Output Voltage: 1V~32V; Output Current (Max): 1A; Switching Frequency: 2.2MHz; Operating Temperature: -40℃~+150℃@(TJ); Synchronous Rectification: Yes; Number of Outputs: 1; Topology: Step-down; Quiescent Current (Iq): 1.5uA; Switch tube (built-in/external): 内置
U4 = CGA6P3X7S1H106K250AB: Capacitance: Tolerance:±10% Tolerance:±10% Voltage Rated:50V Temperature Coefficient:; LCSC Part Name: 10uF ±10% 50V; Supplier Part: C2874233; Manufacturer: TDK; Supplier Footprint: 1210; JLCPCB Part Class: Extended Part; Datasheet: https://atta.szlcsc.com/upload/public/pdf/source/20221212/8CC8E75235799FCBADCCB1AB2750F0E4.pdf; Supplier: LCSC; Tolerance: ±10%; Voltage Rated: 50V
U17-U19 = GPEC132-1002A025R1ZF: Pin Structure:1x10P Pitch:1.27mm Row Spacing:1.27mm Circluar Pins/Square Pins:Square Pins Mounting Type:Brick nogging Number of Rows:Plugin Number of Pins:10P Current Rating (Max):1A Operating Temperature Range:-40℃~+105℃ Operating Temperature Range:-40℃~; LCSC Part Name: 1x10P 间距:1.27mm 方针 立贴; Supplier Part: C7434658; Manufacturer: GREENCONN(格康); Supplier Footprint: SMD,P=1.27mm; JLCPCB Part Class: Extended Part; Datasheet: https://atta.szlcsc.com/upload/public/pdf/source/20240402/586DB3C5151F6C137E1E8E3E65E0AC7D.pdf; Supplier: LCSC; Pin Structure: 1x10P; Pitch: 1.27mm; Row Spacing: 1.27mm; Circluar Pins/Square Pins: Square Pins; Mounting Type: Brick nogging; Number of Rows: Plugin; Number of Pins: 10P; Current Rating (Max): 1A; Operating Temperature Range: -40℃~+105℃
C19-C22 C27 = CC0603KRX7R9BB104: Capacitance: Tolerance:±10% Tolerance:±10% Voltage Rated: Temperature Coefficient:; LCSC Part Name: 100nF ±10% 50V; Supplier Part: C14663; Manufacturer: YAGEO(国巨); Supplier Footprint: 0603; JLCPCB Part Class: Basic Part; Datasheet: https://atta.szlcsc.com/upload/public/pdf/source/20180910/C282072_33301C7F631E79921B82A8DAC6BCC5B3.pdf; Supplier: LCSC; Tolerance: ±10%
C23 = CL10A475KP8NNNC: Capacitance: Tolerance:±10% Tolerance:±10% Voltage Rated: Temperature Coefficient:; LCSC Part Name: 4.7uF ±10% 10V; Supplier Part: C1705; Manufacturer: SAMSUNG(三星); Supplier Footprint: 0603; JLCPCB Part Class: Extended Part; Datasheet: https://atta.szlcsc.com/upload/public/pdf/source/20160218/1457707763339.pdf; Supplier: LCSC; Tolerance: ±10%
C24 C25 = CL10C331JB8NNNC: Capacitance: Tolerance:±5% Tolerance:±5% Voltage Rated: Temperature Coefficient:; LCSC Part Name: 330pF ±5% 50V; Supplier Part: C1664; Manufacturer: SAMSUNG(三星); Supplier Footprint: 0603; JLCPCB Part Class: Basic Part; Datasheet: https://atta.szlcsc.com/upload/public/pdf/source/20160218/1457707763339.pdf; Supplier: LCSC; Tolerance: ±5%
C26 C30 = CS3225X7R106K500NRL: Capacitance: Voltage Rated: Temperature Coefficient:; LCSC Part Name: 10uF 50V; Supplier Part: C2918502; Manufacturer: SAMWHA(三和); Supplier Footprint: 1210; JLCPCB Part Class: Extended Part; Datasheet: https://atta.szlcsc.com/upload/public/pdf/source/20230815/D6EC8E8D4948B4151F2C89DF2FF24A45.pdf; Supplier: LCSC
C28 C29 = GRM188R60J226MEA0D: Capacitance: Tolerance:±20% Tolerance:±20% Voltage Rated: Temperature Coefficient:; LCSC Part Name: 22uF ±20% 6.3V; Supplier Part: C77042; Manufacturer: muRata(村田); Supplier Footprint: 0603; JLCPCB Part Class: Extended Part; Datasheet: https://atta.szlcsc.com/upload/public/pdf/source/20200305/C490387_23319AE8C154DEB24C505E6C82A8106A.pdf; Supplier: LCSC; Tolerance: ±20%
R11-R13 = RC0603FR-0710KL: Type:Thick Film Resistors Resistance: Tolerance:±1% Tolerance:±1% Power(Watts): Overload Voltage (Max): Temperature Coefficient:±100ppm/℃ Temperature Coefficient:±100ppm/℃ Operating Temperature Range:-55℃~+155℃ Operating Temperature Range:-55℃~+155℃; LCSC Part Name: 厚膜电阻 10kΩ ±1% 100mW; Supplier Part: C98220; Manufacturer: YAGEO(国巨); Supplier Footprint: 0603; JLCPCB Part Class: Extended Part; Datasheet: https://atta.szlcsc.com/upload/public/pdf/source/20180927/C295883_E8D83085EA81BD7DE0B2B681138C15EE.pdf; Supplier: LCSC; Type: Thick Film Resistors; Tolerance: ±1%; Temperature Coefficient: ±100ppm/℃; Operating Temperature Range: -55℃~+155℃
R14 R15 = 0603WAF3301T5E: Type:Thick Film Resistors Resistance:3.3kΩ Tolerance:±1% Tolerance:±1% Power(Watts): Overload Voltage (Max): Temperature Coefficient:±100ppm/℃ Temperature Coefficient:±100ppm/℃ Operating Temperature Range:-55℃~+155℃ Operating Temperature Range:-55℃~+155℃; LCSC Part Name: 3.3kΩ ±1% 100mW 厚膜电阻; Supplier Part: C22978; Manufacturer: UNI-ROYAL(厚声); Supplier Footprint: 0603; JLCPCB Part Class: Basic Part; Datasheet: https://atta.szlcsc.com/upload/public/pdf/source/20200306/C422600_1E6D84923E4A46A82E41ADD87F860B5C.pdf; Supplier: LCSC; Type: Thick Film Resistors; Tolerance: ±1%; Temperature Coefficient: ±100ppm/℃; Operating Temperature Range: -55℃~+155℃
R16 = RS-03K6202FT: Type:Thick Film Resistors Resistance:62kΩ Tolerance:±1% Tolerance:±1% Power(Watts): Overload Voltage (Max): Temperature Coefficient:±100ppm/℃ Temperature Coefficient:±100ppm/℃ Operating Temperature Range:-55℃~+155℃ Operating Temperature Range:-55℃~+155℃; LCSC Part Name: 厚膜电阻 62kΩ ±1% 100mW; Supplier Part: C95332; Manufacturer: FH(风华); Supplier Footprint: 0603; JLCPCB Part Class: Extended Part; Datasheet: https://atta.szlcsc.com/upload/public/pdf/source/20140616/1457707091974.pdf; Supplier: LCSC; Type: Thick Film Resistors; Tolerance: ±1%; Temperature Coefficient: ±100ppm/℃; Operating Temperature Range: -55℃~+155℃
R17 = RC0603FR-07150KL: Type:Thick Film Resistors Resistance: Tolerance:±1% Tolerance:±1% Power(Watts): Overload Voltage (Max): Temperature Coefficient:±100ppm/℃ Temperature Coefficient:±100ppm/℃ Operating Temperature Range:-55℃~+155℃ Operating Temperature Range:-55℃~+155℃; LCSC Part Name: 厚膜电阻 150kΩ ±1% 100mW; Supplier Part: C114660; Manufacturer: YAGEO(国巨); Supplier Footprint: 0603; JLCPCB Part Class: Extended Part; Datasheet: https://atta.szlcsc.com/upload/public/pdf/source/20180821/C275644_0D56F95EFF785E7D9A1FEF436B37DA78.pdf; Supplier: LCSC; Type: Thick Film Resistors; Tolerance: ±1%; Temperature Coefficient: ±100ppm/℃; Operating Temperature Range: -55℃~+155℃
R18 = RC0603FR-07220KL: Type:Thick Film Resistors Resistance: Tolerance:±1% Tolerance:±1% Power(Watts): Overload Voltage (Max): Temperature Coefficient:±100ppm/℃ Temperature Coefficient:±100ppm/℃ Operating Temperature Range:-55℃~+155℃ Operating Temperature Range:-55℃~+155℃; LCSC Part Name: 厚膜电阻 220kΩ ±1% 100mW; Supplier Part: C123420; Manufacturer: YAGEO(国巨); Supplier Footprint: 0603; JLCPCB Part Class: Extended Part; Datasheet: https://atta.szlcsc.com/upload/public/pdf/source/20180821/C275644_0D56F95EFF785E7D9A1FEF436B37DA78.pdf; Supplier: LCSC; Type: Thick Film Resistors; Tolerance: ±1%; Temperature Coefficient: ±100ppm/℃; Operating Temperature Range: -55℃~+155℃
R19 = AC0603FR-07110KL: Type:Thick Film Resistors Resistance: Tolerance:±1% Tolerance:±1% Power(Watts): Overload Voltage (Max): Temperature Coefficient:±100ppm/℃ Temperature Coefficient:±100ppm/℃ Operating Temperature Range:-55℃~+155℃ Operating Temperature Range:-55℃~+155℃; LCSC Part Name: 厚膜电阻 110kΩ ±1% 100mW; Supplier Part: C227551; Manufacturer: YAGEO(国巨); Supplier Footprint: 0603; JLCPCB Part Class: Extended Part; Datasheet: https://atta.szlcsc.com/upload/public/pdf/source/20180927/C229861_4ABDC471507C1ED6AFB4BA66AFC8620A.pdf; Supplier: LCSC; Type: Thick Film Resistors; Tolerance: ±1%; Temperature Coefficient: ±100ppm/℃; Operating Temperature Range: -55℃~+155℃
R20 = RC0603FR-0791KL: Type:Thick Film Resistors Resistance: Tolerance:±1% Tolerance:±1% Power(Watts): Overload Voltage (Max): Temperature Coefficient:±100ppm/℃ Temperature Coefficient:±100ppm/℃ Operating Temperature Range:-55℃~+155℃ Operating Temperature Range:-55℃~+155℃; LCSC Part Name: 厚膜电阻 91kΩ ±1% 100mW; Supplier Part: C137671; Manufacturer: YAGEO(国巨); Supplier Footprint: 0603; JLCPCB Part Class: Extended Part; Datasheet: https://atta.szlcsc.com/upload/public/pdf/source/20180821/C275644_0D56F95EFF785E7D9A1FEF436B37DA78.pdf; Supplier: LCSC; Type: Thick Film Resistors; Tolerance: ±1%; Temperature Coefficient: ±100ppm/℃; Operating Temperature Range: -55℃~+155℃
R21 = RC0603FR-0739KL: Type:Thick Film Resistors Resistance: Tolerance:±1% Tolerance:±1% Power(Watts): Overload Voltage (Max): Temperature Coefficient:±100ppm/℃ Temperature Coefficient:±100ppm/℃ Operating Temperature Range:-55℃~+155℃ Operating Temperature Range:-55℃~+155℃; LCSC Part Name: 厚膜电阻 39kΩ ±1% 100mW; Supplier Part: C163424; Manufacturer: YAGEO(国巨); Supplier Footprint: 0603; JLCPCB Part Class: Extended Part; Datasheet: https://atta.szlcsc.com/upload/public/pdf/source/20181009/C309620_DA5935B6E1D48212CB7A533FE518B3C2.pdf; Supplier: LCSC; Type: Thick Film Resistors; Tolerance: ±1%; Temperature Coefficient: ±100ppm/℃; Operating Temperature Range: -55℃~+155℃
R22 = RC0603FR-07160KL: Type:Thick Film Resistors Resistance: Tolerance:±1% Tolerance:±1% Power(Watts): Overload Voltage (Max): Temperature Coefficient:±100ppm/℃ Temperature Coefficient:±100ppm/℃ Operating Temperature Range:-55℃~+155℃ Operating Temperature Range:-55℃~+155℃; LCSC Part Name: 厚膜电阻 160kΩ ±1% 100mW; Supplier Part: C137793; Manufacturer: YAGEO(国巨); Supplier Footprint: 0603; JLCPCB Part Class: Extended Part; Datasheet: https://atta.szlcsc.com/upload/public/pdf/source/20180821/C275644_0D56F95EFF785E7D9A1FEF436B37DA78.pdf; Supplier: LCSC; Type: Thick Film Resistors; Tolerance: ±1%; Temperature Coefficient: ±100ppm/℃; Operating Temperature Range: -55℃~+155℃
R23-R27 = 0603WAF1003T5E: Type:Thick Film Resistors Resistance:100kΩ Tolerance:±1% Tolerance:±1% Power(Watts): Overload Voltage (Max): Temperature Coefficient:±100ppm/℃ Temperature Coefficient:±100ppm/℃ Operating Temperature Range:-55℃~+155℃ Operating Temperature Range:-55℃~+155℃; LCSC Part Name: 100kΩ ±1% 100mW 厚膜电阻; Supplier Part: C25803; Manufacturer: UNI-ROYAL(厚声); Supplier Footprint: 0603; JLCPCB Part Class: Basic Part; Datasheet: https://atta.szlcsc.com/upload/public/pdf/source/20200306/C422600_1E6D84923E4A46A82E41ADD87F860B5C.pdf; Supplier: LCSC; Type: Thick Film Resistors; Tolerance: ±1%; Temperature Coefficient: ±100ppm/℃; Operating Temperature Range: -55℃~+155℃
U5 = TS5USBC412YFFR: Switch Circuit:- Number of Channels:2 Supply Voltage:2.3V~5.5V Supply Voltage:2.3V~5.5V On-State Resistance (Max):9Ω Operating Temperature:0℃~+70℃ Operating Temperature:0℃~+70℃; Supplier Part: C2150852; Manufacturer: TI(德州仪器); Supplier Footprint: DSBGA-12; JLCPCB Part Class: Extended Part; Datasheet: https://www.ti.com/cn/lit/gpn/ts5usbc41; Supplier: LCSC; Number of Channels: 2; Supply Voltage: 2.3V~5.5V; On-State Resistance (Max): 9Ω; Operating Temperature: 0℃~+70℃
U6 = TPS25730DREFR: Supplier Part: C22438973; Supplier Footprint: QFN38-4X6-0.4; JLCPCB Part Class: Extended Part; Supplier: LCSC
U11 U12 = CGA1210X5R226K350RT: Capacitance:22uF Tolerance:±10% Tolerance:±10% Voltage Rated: Temperature Coefficient:; LCSC Part Name: 22uF ±10% 35V; Supplier Part: C6120016; Manufacturer: HRE(芯声); Supplier Footprint: 1210; JLCPCB Part Class: Extended Part; Datasheet: https://atta.szlcsc.com/upload/public/pdf/source/20240229/B394560356D0E8099C4BF336FC93CE67.pdf; Supplier: LCSC; Tolerance: ±10%
USB1 = GT-USB-7100A: Connector Type:Type-C Standard:USB 2.0 Gender:Female Number of Ports:1 Number of Contacts:8P Mounting Style:Sink board Current Rating - Power (Max):5A Contact Material:高导铜 Contact Plating:Gold Operating Temperature Range:-40℃~+85℃ Operating Temperature Ra; LCSC Part Name: Type-C 母 沉板; Supplier Part: C7469646; Manufacturer: G-Switch(品赞); Supplier Footprint: SMD; JLCPCB Part Class: Extended Part; Datasheet: https://atta.szlcsc.com/upload/public/pdf/source/20240103/5A98FEF604E8D03CC845D83CAD1837C7.pdf; Supplier: LCSC; Connector Type: Type-C; Standard: USB 2.0; Gender: Female; Number of Ports: 1; Number of Contacts: 8P; Mounting Style: Sink board; Current Rating - Power (Max): 5A; Contact Material: 高导铜; Contact Plating: Gold; Operating Temperature Range: -40℃~+85℃

## Nets
3V3: C4.2 C5.2 C27.1 C28.2 L1.2 R14.2 R15.1 R23.2 R24.2 R25.2 R26.2 R27.2 U3.8(VOUT/FB) U5.B1(VCC) U6.38(VIN_3V3) U18.1
GND: C3.2 C4.1 C5.1 C6.1 C7.2 C19.1 C20.1 C21.1 C22.1 C23.1 C24.1 C25.1 C26.1 C27.2 C28.1 C29.1 C30.2 C31.2 R11.1 R12.1 R13.1 R16.1 R18.1 R19.1 R21.1 U3.1(RTorMODE/SYNC) U3.9(GND) U4.1 U5.A1(SEL1) U5.B2(SEL2) U5.B3(GND) U5.B4(OE#) U6.11(GND) U6.12(GND) U6.14(GND) U6.16(GND) U6.17(GND) U6.31(GND) U6.34(GND) U6.35(GND) U6.39(GND) U11.1 U12.1 U17.1 U17.2 U17.8 U17.9 U17.10 U18.2 U18.4 U18.7 U18.10 U19.1 U19.4 U19.7 U19.10 USB1.A12(GND) USB1.B12(GND) USB1.EH1 USB1.EH2
ADCIN1: R16.2 R17.1 U6.2(ADCIN1)
ADCIN2: C29.2 R17.2 R18.2 R20.2 R22.2 U6.1(LDO_3V3) U6.3(ADCIN2)
ADCIN3: R19.2 R20.1 U6.5(ADCIN3)
ADCIN4: R21.2 R22.1 U6.7(ADCIN4)
DRAIN: U6.15(DRAIN) U6.30(DRAIN) U6.40(DRAIN)
USB2.D_N: U5.C4(D1–) U18.9
USB2.D_P: U5.C3(D1+) U18.8
USB2.FLT_X: U5.A4(FLT#) U19.2
USB_DBG.CAP_MIS: R27.1 U6.6(CAP_MIS) U18.3
USB_DBG.FAULT_IN_X: R25.1 U6.18(FAULT_IN#) U19.6
USB_DBG.I2Ct_SCL: R15.2 U6.9(I2Ct_SCL) U18.6
USB_DBG.I2Ct_SDA: R14.1 U6.8(I2Ct_SDA) U18.5
USB_DBG.PLUG_EVENT: R23.1 U6.37(PLUG_EVENT) U19.3
USB_DBG.PLUG_FLIP: R26.1 U6.13(PLUG_FLIP) U19.8
USB_DBG.SINK_EN_X: R24.1 U6.19(SINK_EN#) U19.5
V_MAIN: C7.1 C26.2 L2.1 U6.20(PPHV) U6.21(PPHV) U6.22(PPHV) U11.2 U12.2 U17.3 U17.4 U17.5 U17.6 U17.7
Net-(C2-1): C2.1 U3.6(BOOT)
Net-(C2-2): C2.2 L1.1 U3.5(SW)
Net-(C3-1): C3.1 C6.2 L2.2 R1.2 U3.3(EN/UVLO) U3.4(VIN)
Net-(C19-2): C19.2 C20.2 C21.2 C22.2 C23.2 U6.23(VBUS_IN) U6.24(VBUS_IN) U6.25(VBUS_IN) U6.32(VBUS) U6.33(VBUS) USB1.A9(VBUS) USB1.B9(VBUS)
Net-(C24-2): C24.2 U6.29(CC2) USB1.B5(CC2)
Net-(C25-2): C25.2 U6.28(CC1) USB1.A5(CC1)
Net-(C30-1): C30.1 U6.4(LDO_1V5)
Net-(C31-1): C31.1 U3.7(VCC)
Net-(R1-1): R1.1 U4.2
Net-(R11-2): R11.2 U6.36(RESERVED)
Net-(R12-2): R12.2 U6.27(RESERVED)
Net-(R13-2): R13.2 U6.26(RESERVED)
Net-(U5-A2): U5.A2(D+) USB1.A6(D+)
Net-(U5-A3): U5.A3(D–) USB1.A7(D-)

Not connected (* = marked no-connect by the designer): U3 2(PGOOD)*; U5 C1(D2+)* C2(D2–)*; U6 10(DBG_ACC)*; U19 9

## Notes on the sheets
sheet 1
- V_MAIN:     5-20V
- V_IN:     5-20V {5V,9V,12V,15V,20V}
  V_OUT: 3V3
  I_max: 0.5A
  I_nom: 0.1A
  Designed in TI's Webench prioritizing high-efficiency
- V_OUT:     3V3
  I_out(max): 0.5A
  I_Out(nom): 0.1A
- 1uF eff @ 3V3
sheet 2
- Always enabled with GND
- With SEL1: D- -> D1-
  With SEL2: D+ -> D1+
- V_MAIN
  Vout = 5V...20V
  {5V,9V,12V,15V,20V}
  Imax = 5A
- When USB PD source capability is
  below Sink request set by ADCINx
  Highest Source voltage/current will be provided
  CAP_MIS flag will be low
- I2C Address: 0x20
  set from ADCIN1 and 2
  (see Table 8-3 in DS)
- ADCINx Voltage Dividers
  [Datasheet]
  Decoding: Table 8-1
  ADCIN1: Table 8-4
  ADCIN2: Table 8-5
  ADCIN3/4: Table 8-6
- USB Type C Connector
  Limited to pins for PD and USB2.0
sheet 3
- 1.27mm Pins have current capacity of 1.20A
  I_max = 5A -> 5 pins each for V_MAIN and GND
- CASTELLETATED HOLES
- CASTELLETATED HOLES
- Pin 9 is open
